# EAGLE design GPSReceiver_Kenwood710_tiny (EAGLE 6.5.0)
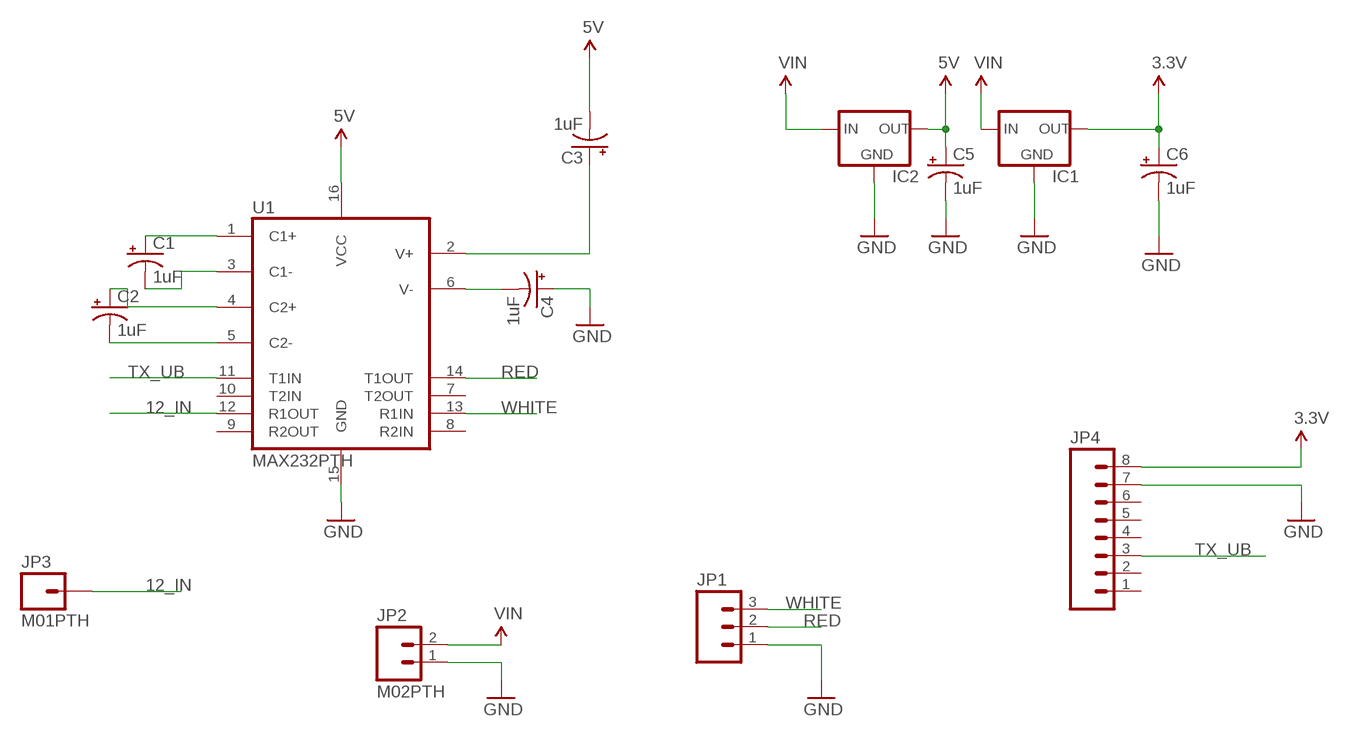
[diagram p0: schematic, sheet 1]

## Parts
C1  1uF  CAP_POLPTH2  [CPOL-RADIAL-10UF-25V]
C2  1uF  CAP_POLPTH2  [CPOL-RADIAL-10UF-25V]
C3  1uF  CAP_POLPTH2  [CPOL-RADIAL-10UF-25V]
C4  1uF  CAP_POLPTH2  [CPOL-RADIAL-10UF-25V]
C5  1uF  CAP_POLPTH2  [CPOL-RADIAL-10UF-25V]
C6  1uF  CAP_POLPTH2  [CPOL-RADIAL-10UF-25V]
IC1  V_REG_78XX-TO-220  [TO-220-ALT]
IC2  V_REG_78XX-TO-220  [TO-220-ALT]
JP1  M03PTH  [1X03]
JP2  M02PTH  [1X02]
JP3  M01PTH  [1X01]
JP4  M08LOCK  [1X08_LOCK]
U1  MAX232PTH  [DIL16]

## Nets
3.3V: C6.1(+) IC1.OUT JP4.8
5V: C3.2(-) C5.1(+) IC2.OUT U1.16(VCC)
12_IN: JP3.1 U1.12(R1OUT)
GND: C4.1(+) C5.2(-) C6.2(-) IC1.GND IC2.GND JP1.1 JP2.1 JP4.7 U1.15(GND)
N$1: C1.1(+) U1.1(C1+)
N$2: C1.2(-) U1.3(C1-)
N$3: C2.1(+) U1.4(C2+)
N$4: C2.2(-) U1.5(C2-)
N$5: C3.1(+) U1.2(V+)
N$6: C4.2(-) U1.6(V-)
RED: JP1.2 U1.14(T1OUT)
TX_UB: JP4.3 U1.11(T1IN)
VIN: IC1.IN IC2.IN JP2.2
WHITE: JP1.3 U1.13(R1IN)
Unconnected: JP4.1 JP4.2 JP4.4 JP4.5 JP4.6 U1.7(T2OUT) U1.8(R2IN) U1.9(R2OUT) U1.10(T2IN)

## Library data of the parts
C1-C6 = SparkFun-Passives:CAP_POL: Capacitor Polarized These are standard SMD and PTH capacitors. Normally 10uF, 47uF, and 100uF in electrolytic and tantalum varieties. Always verify the external diameter of the through hole cap, it varies with capacity, voltage, and manufacturer. The EIA devices should be standard.
IC1 IC2 = SparkFun-PowerIC:V_REG_78XX: Voltage Regulator Standard 7805 5V regulator. IGO (Input Ground Output). Spark Fun Electronics SKU : COM-00107
JP1 = SparkFun-Connectors:M03: Header 3 Standard 3-pin 0.1" header. Use with straight break away headers (SKU : PRT-00116), right angle break away headers (PRT-00553), swiss pins (PRT-00743), machine pins (PRT-00117), and female headers (PRT-00115). Molex polarized connector foot print use with SKU : PRT-08232 with associated crimp pins and housings.
JP2 = SparkFun-Connectors:M02: Standard 2-pin 0.1" header. Use with - straight break away headers ( PRT-00116) - right angle break away headers (PRT-00553) - swiss pins (PRT-00743) - machine pins (PRT-00117) - female headers (PRT-00115) Molex polarized connector foot print use with: PRT-08233 with associated crimp pins and housings. 2.54_SCREWTERM for use with PRT-10571. 3.5mm Screw Terminal footprints for PRT-08084 5mm Screw Terminal footprints for use with PRT-08433
JP3 = SparkFun-Connectors:M01: Header 1 Standard 1-pin 0.1" header. Use with straight break away headers (SKU : PRT-00116), right angle break away headers (PRT-00553), swiss pins (PRT-00743), machine pins (PRT-00117), and female headers (PRT-00115).
JP4 = SparkFun-Connectors:M08: Header 8 Standard 8-pin 0.1" header. Use with straight break away headers (SKU : PRT-00116), right angle break away headers (PRT-00553), swiss pins (PRT-00743), machine pins (PRT-00117), and female headers (PRT-00115).
U1 = SparkFun-DigitalIC:MAX232: RS232 Transceiver Very common IC. This is generically called 'MAX232', but works with the 3V equivalent MAX3232 generic ICs. Field tested and mother approved. Spark Fun Electronics SKU : COM-00316 (DIP) and COM-00589 (SMD)

## Net classes
0 default: width 0.406 mm, drill 0.3 mm, clearance 0.559 mm

## Board
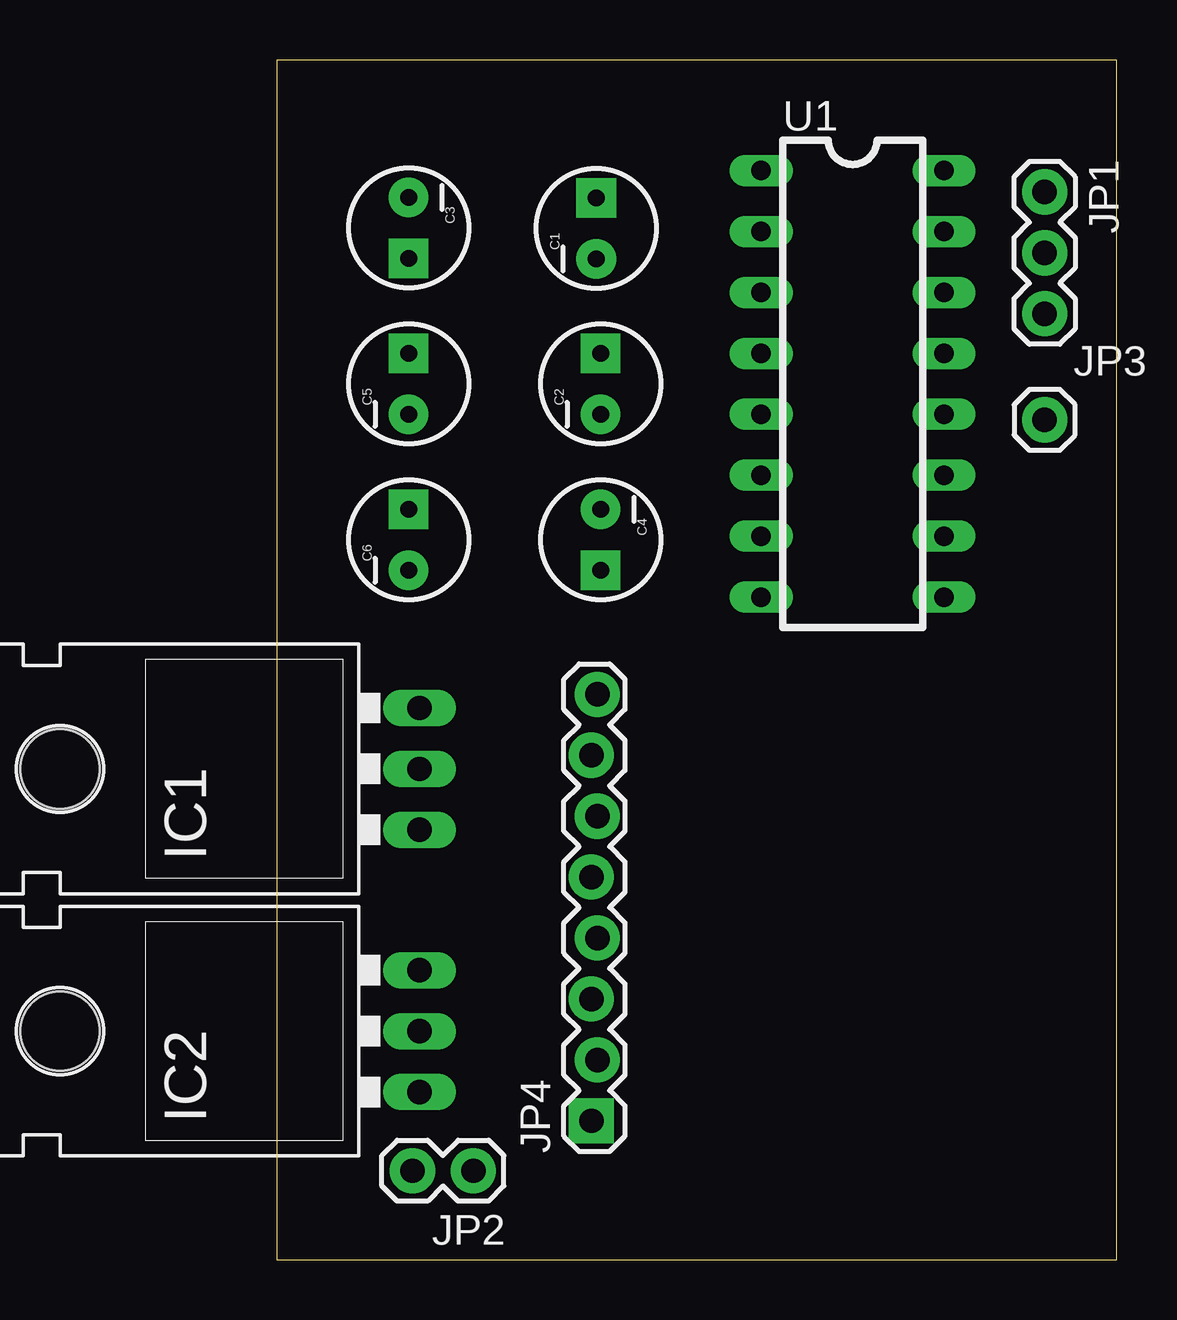
[diagram p1: board, top side]
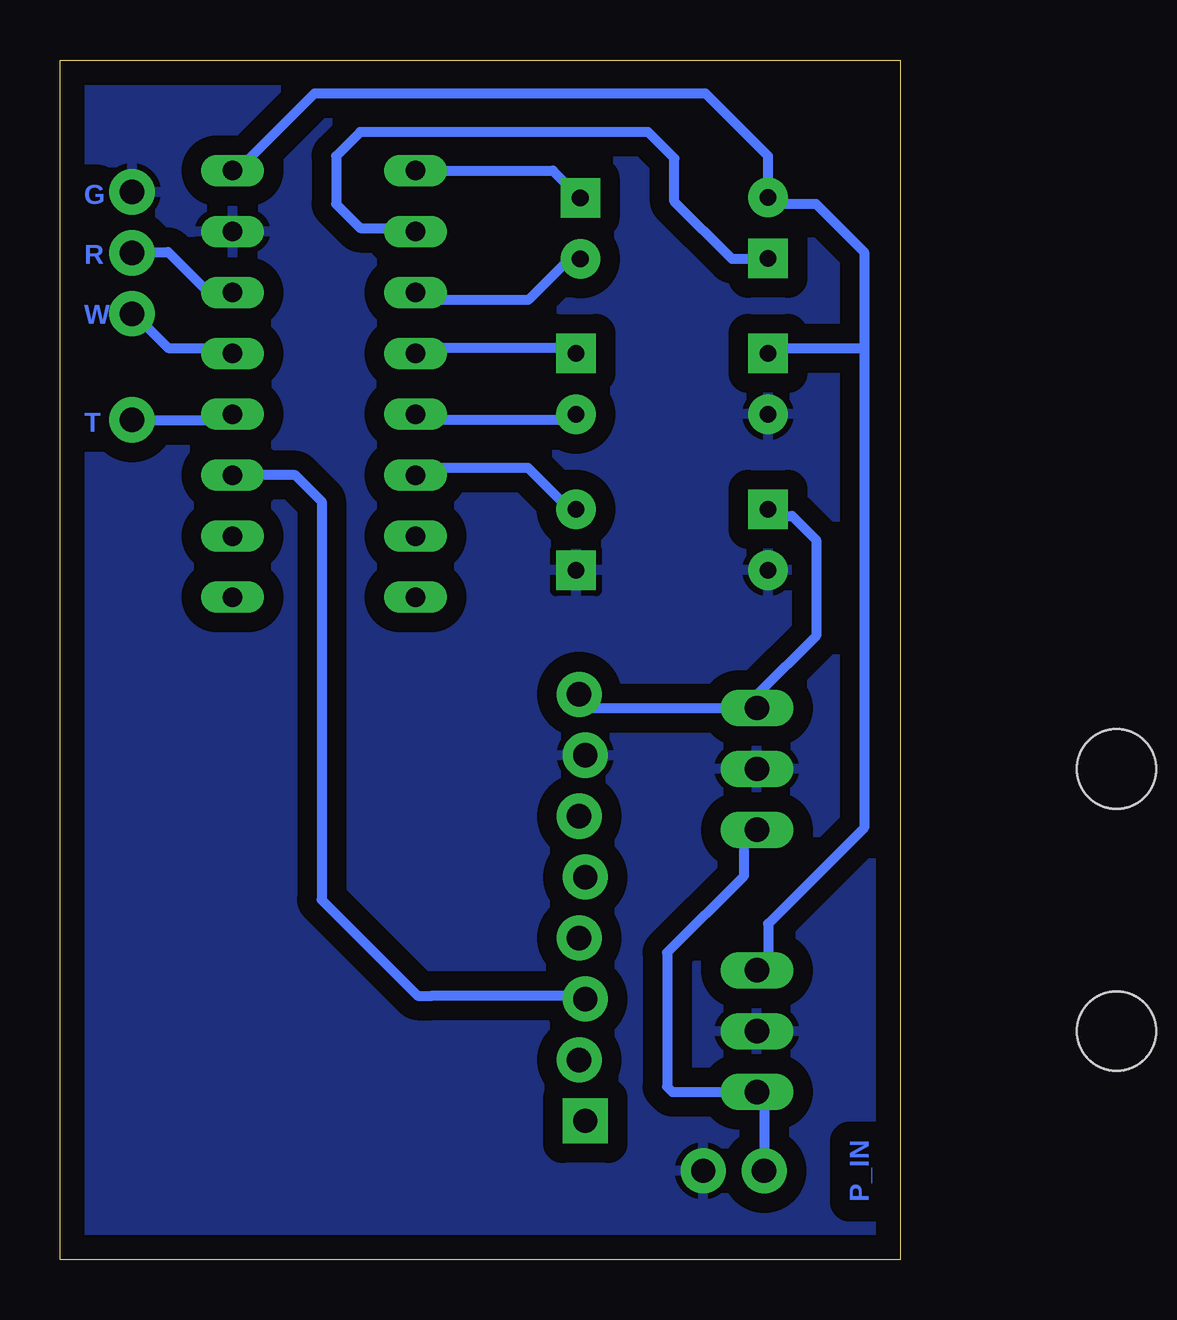
[diagram p2: board, bottom side, seen from below]

Size 35 x 50 mm. Coordinates in mm from the lower left corner, seen from the top.
Outline: 0,0 35,0 35,50 0,50 0,0
Copper layers (1*16): Top 0.035mm / dielectric 1.5mm / Bottom 0.035mm
Design rules "default": minimum track width 10mil, minimum drill 24mil, track to track 8mil, track to pad 8mil, pad to pad 8mil, via to via 8mil, smd to smd 8mil, copper to edge 40mil, drill to drill 8mil, minimum pad ring 10mil, minimum via ring 8mil, stop-mask expansion 4mil, vias tented up to drill 0mil, thermal gap 10mil

### Footprints (pad centres in the part's own frame; a part is rotated, then mirrored left to right if it is on the bottom)
CPOL-RADIAL-10UF-25V = drill 0.7 pad 1.651 square: 1 1.27,0 | drill 0.7 pad 1.651: 2 -1.27,0
TO-220-ALT = drill 1.016 long: GND 0,-3.81; IN -2.54,-3.81; OUT 2.54,-3.81 | hole 3.302: 0,11.176
1X03 = drill 1.016 pad 1.88: 1 0,0; 2 2.54,0; 3 5.08,0
1X02 = drill 1.016 pad 1.88: 1 0,0; 2 2.54,0
1X01 = drill 1.016 pad 1.88: 1 0,0
1X08_LOCK = drill 1.016 pad 1.88 square: 1 0,0.127 | drill 1.016 pad 1.88: 2 2.54,-0.127; 3 5.08,0.127; 4 7.62,-0.127; 5 10.16,0.127; 6 12.7,-0.127; 7 15.24,0.127; 8 17.78,-0.127
DIL16 = drill 0.813 long: 1 -8.89,-3.81; 2 -6.35,-3.81; 3 -3.81,-3.81; 4 -1.27,-3.81; 5 1.27,-3.81; 6 3.81,-3.81; 7 6.35,-3.81; 8 8.89,-3.81; 9 8.89,3.81; 10 6.35,3.81; 11 3.81,3.81; 12 1.27,3.81; 13 -1.27,3.81; 14 -3.81,3.81; 15 -6.35,3.81; 16 -8.89,3.81

### Placement (x,y rotation side)
C1  13.32,42.98 90 top
C2  13.5,36.5 90 top
C3  5.5,43 270 top
C4  13.5,30 270 top
C5  5.5,36.5 90 top
C6  5.5,30 90 top
IC1  2.15,20.45 90 top
IC2  2.15,9.52 90 top
JP1  32,44.5 270 top
JP2  8.2,3.7 180 top
JP3  32,35 0 top
JP4  13.24,5.78 90 top
U1  24,36.5 270 top

### Tracks (layer width: path | path; a pad name or v marks a point on that pad's centre or on a via)
3.3V
  Bottom 0.406: JP4.8 13.5,23 6.5,23 IC1.OUT 5.96,23.54 3.5,26 3.5,30 4.5,31 5.5,31 C6.1
5V
  Bottom 0.406: IC2.OUT 5.5,12 5.5,14 1.5,18 1.5,38 | C5.1 5.5,38 1.5,38 | 1.5,38 1.5,42 3.5,44 5.5,44 C3.2 5.5,46 8.1,48.6 24.4,48.6 27.61,45.39 U1.16
12_IN
  Bottom 0.406: JP3.1 28.5,35 U1.12
GND
  pour Bottom (isolate 0.813): 0,50 35,50 35,0 0,0
N$1
  Bottom 0.406: U1.1 14.46,45.39 C1.1
N$2
  Bottom 0.406: U1.3 19.5,40 15.5,40 13.5,42 C1.2
N$3
  Bottom 0.406: U1.4 19.5,38 13.5,38 C2.1
N$4
  Bottom 0.406: U1.5 19.5,35 13.5,35 C2.2
N$5
  Bottom 0.406: U1.2 20.34,43 22.5,43 23.5,44 23.5,46 22.5,47 10.5,47 9.4,45.9 9.4,44.1 7,41.7 5.53,41.7 C3.1
N$6
  Bottom 0.406: U1.6 19.5,33 15.5,33 13.5,31 C4.2
RED
  Bottom 0.406: U1.14 28.5,40 30.5,42 31.5,42 JP1.2
TX_UB
  Bottom 0.406: JP4.3 13.5,11 16.9,11 19.5,11 20.1,11 24.1,15 24.1,31.6 25.19,32.69 U1.11
VIN
  Bottom 0.406: IC1.IN 6.5,18 6.5,16 9.7,12.8 9.7,7.2 9.48,6.98 IC2.IN 5.66,6.68 JP2.2
WHITE
  Bottom 0.406: U1.13 28.5,38 30.5,38 31.5,39 JP1.3

### Text on the board
Bottom: G | R | W | T | P_IN